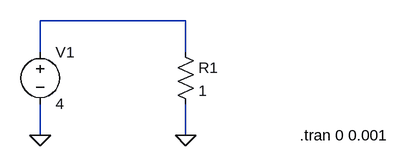
[diagram p0: schematic simple_resistor_ver2.asc]
simple_resistor_ver2.asc, the LTspice schematic file:
Version 4
SHEET 1 880 680
WIRE 432 192 208 192
WIRE 208 240 208 192
WIRE 432 240 432 192
WIRE 208 368 208 320
WIRE 432 368 432 320
FLAG 208 368 0
FLAG 432 368 0
SYMBOL voltage 208 224 R0
SYMATTR InstName V1
SYMATTR Value 4
SYMBOL res 416 224 R0
SYMATTR InstName R1
SYMATTR Value 1
TEXT 608 368 Left 2 !.tran 0 0.001

The netlist it stands for:
* simple_resistor_ver2.asc
V1 N001 0 4
R1 N001 0 1
.tran 0 0.001
.backanno
.end